# Altium schematic sheet 50-BLANK 101-120.SchDoc
size 594 x 420 mm
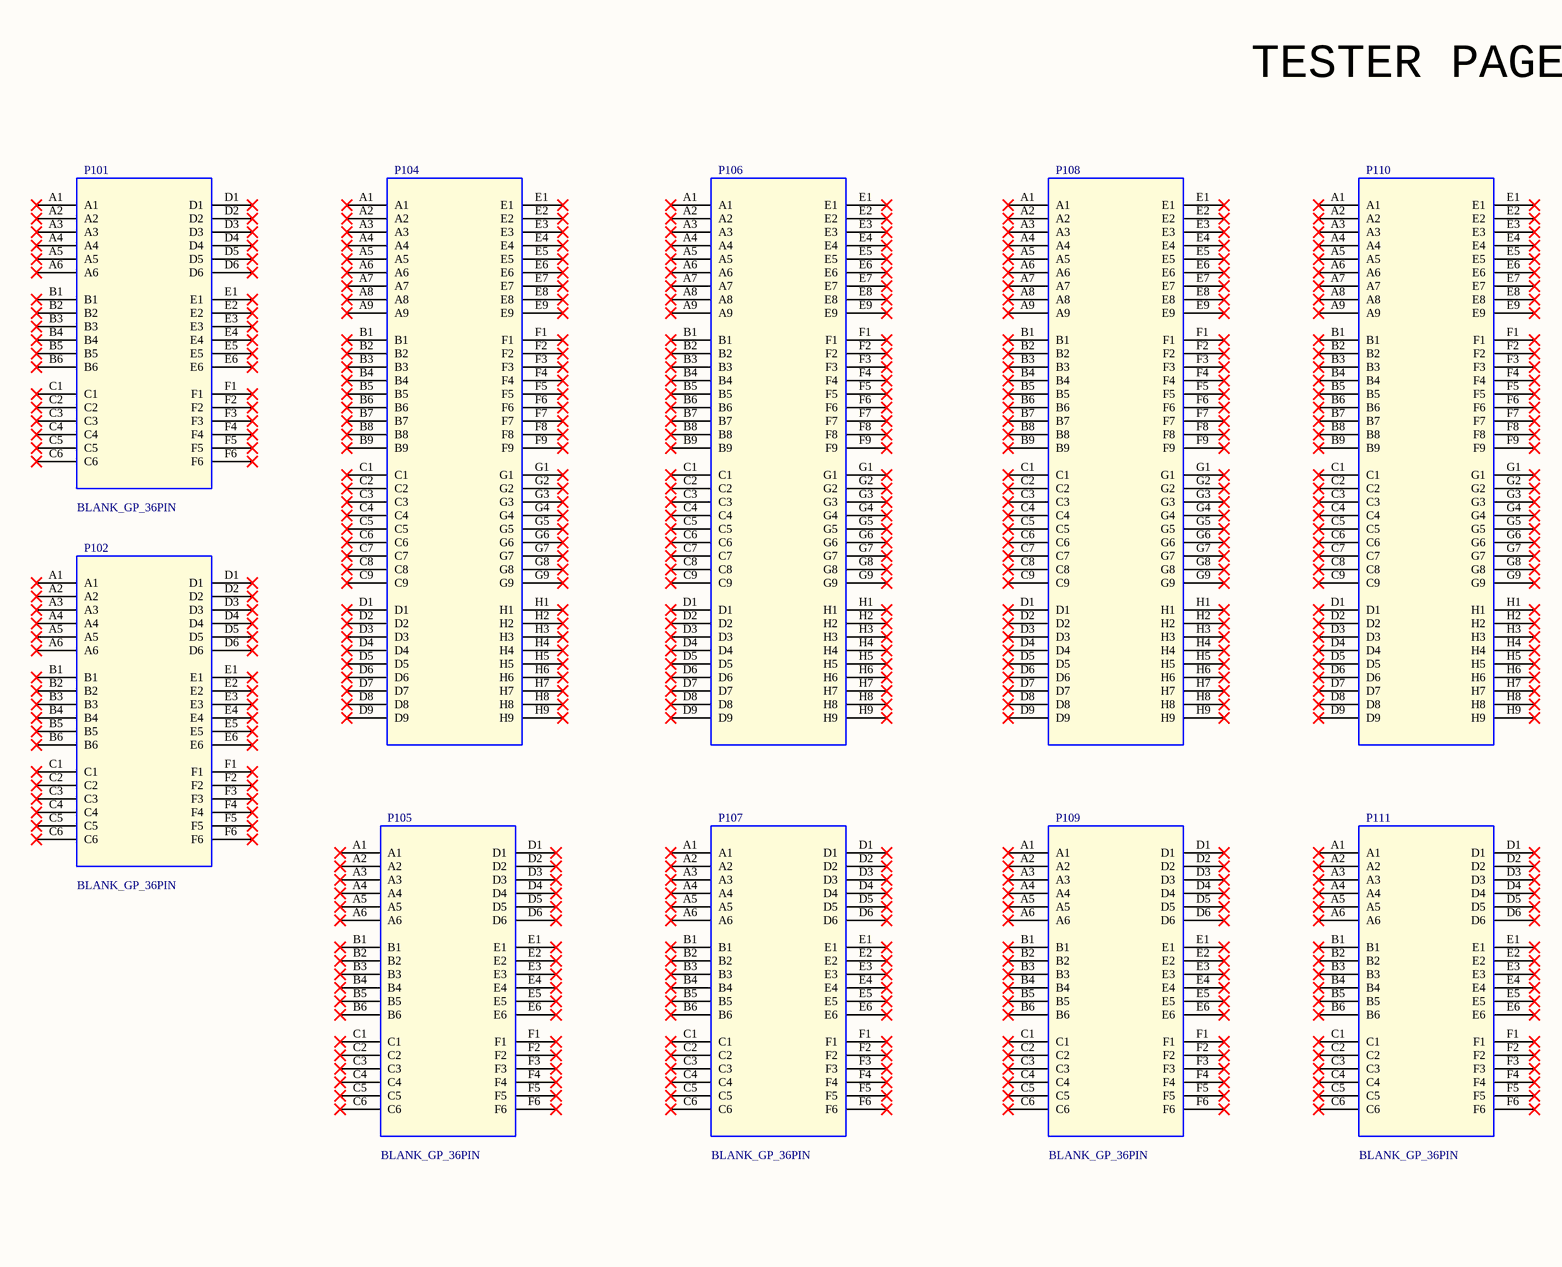
[diagram p0: 50-BLANK 101-120.SchDoc, left]
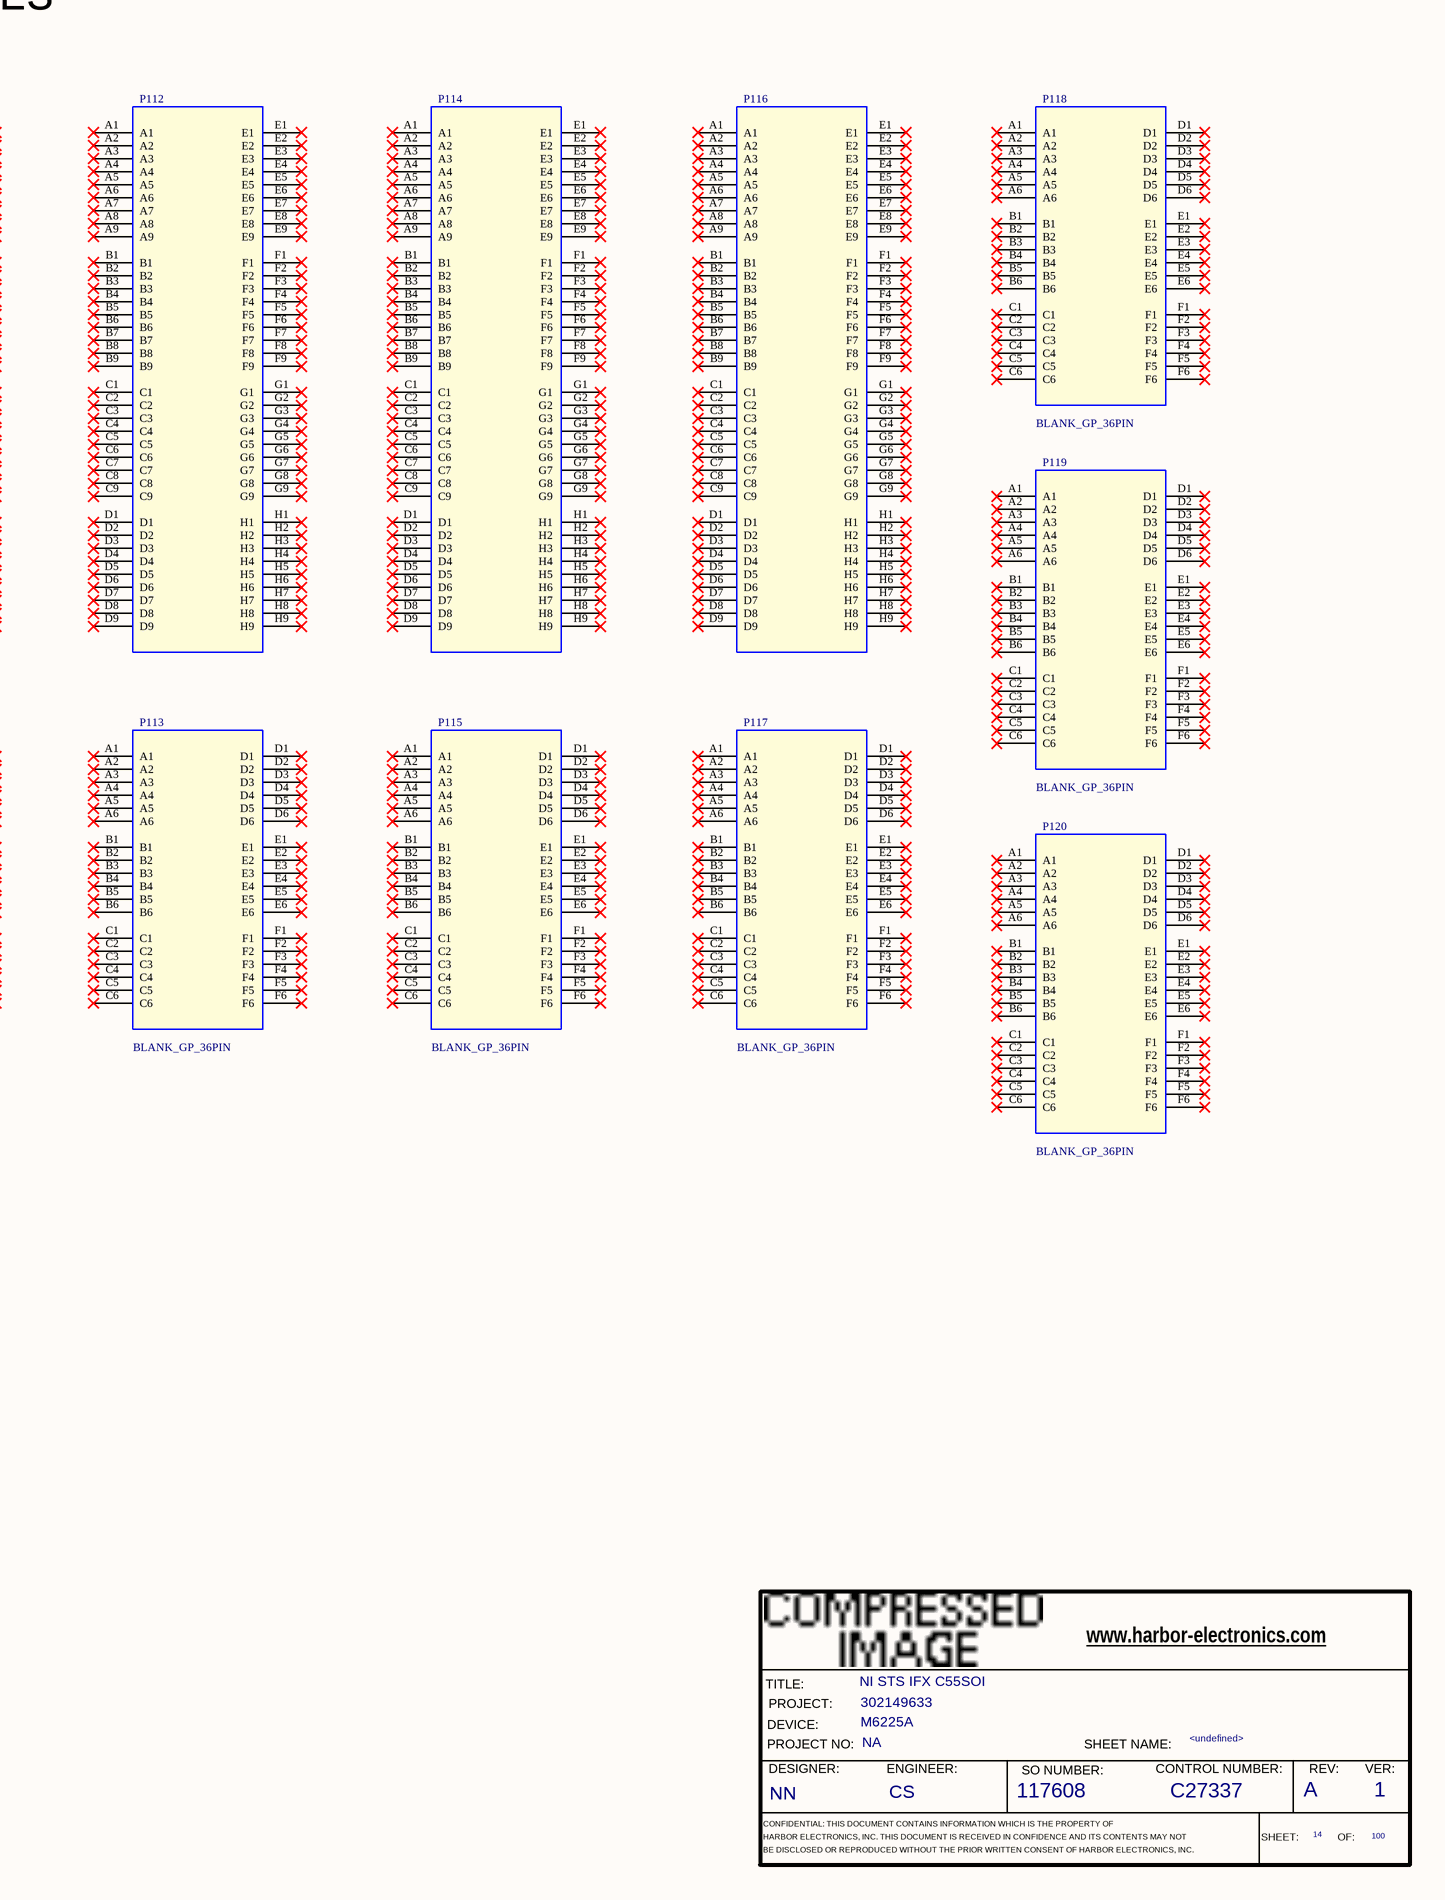
[diagram p1: 50-BLANK 101-120.SchDoc, right]

## Parts
*  RevCode: A  Title: NI STS IFX C55SOI  Page Number: 14  Page Count: 100  Engineer: CS  Designer: NN  SO Number: 117608  Control Number: C27337  Version: 1  Page Name: <undefined>  PROJECT: 302149633  DEVICE: M6225A  PROJECT NO.: NA  (hidden comment: HE_DEFAULT)  (graphical)
P101  BLANK_GP_36PIN  [285092A-08_36PIN_NOVIA]
P102  BLANK_GP_36PIN  [285092A-08_36PIN_NOVIA]
P104  (no value)  [285092A-08_72PIN_NOVIA]
P105  BLANK_GP_36PIN  [285092A-08_36PIN_NOVIA]
P106  (no value)  [285092A-08_72PIN_NOVIA]
P107  BLANK_GP_36PIN  [285092A-08_36PIN_NOVIA]
P108  (no value)  [285092A-08_72PIN_NOVIA]
P109  BLANK_GP_36PIN  [285092A-08_36PIN_NOVIA]
P110  (no value)  [285092A-08_72PIN_NOVIA]
P111  BLANK_GP_36PIN  [285092A-08_36PIN_NOVIA]
P112  (no value)  [285092A-08_72PIN_NOVIA]
P113  BLANK_GP_36PIN  [285092A-08_36PIN_NOVIA]
P114  (no value)  [285092A-08_72PIN_NOVIA]
P115  BLANK_GP_36PIN  [285092A-08_36PIN_NOVIA]
P116  (no value)  [285092A-08_72PIN_NOVIA]
P117  BLANK_GP_36PIN  [285092A-08_36PIN_NOVIA]
P118  BLANK_GP_36PIN  [285092A-08_36PIN_NOVIA]
P119  BLANK_GP_36PIN  [285092A-08_36PIN_NOVIA]
P120  BLANK_GP_36PIN  [285092A-08_36PIN_NOVIA]

## Nets

Not connected (* = marked no-connect by the designer): P101 A1* A2* A3* A4* A5* A6* B1* B2* B3* B4* B5* B6* C1* C2* C3* C4* C5* C6* D1* D2* D3* D4* D5* D6* E1* E2* E3* E4* E5* E6* F1* F2* F3* F4* F5* F6*; P102 A1* A2* A3* A4* A5* A6* B1* B2* B3* B4* B5* B6* C1* C2* C3* C4* C5* C6* D1* D2* D3* D4* D5* D6* E1* E2* E3* E4* E5* E6* F1* F2* F3* F4* F5* F6*; P104 A1* A2* A3* A4* A5* A6* A7* A8* A9* B1* B2* B3* B4* B5* B6* B7* B8* B9* C1* C2* C3* C4* C5* C6* C7* C8* C9* D1* D2* D3* D4* D5* D6* D7* D8* D9* E1* E2* E3* E4* E5* E6* E7* E8* E9* F1* F2* F3* F4* F5* F6* F7* F8* F9* G1* G2* G3* G4* G5* G6* G7* G8* G9* H1* H2* H3* H4* H5* H6* H7* H8* H9*; P105 A1* A2* A3* A4* A5* A6* B1* B2* B3* B4* B5* B6* C1* C2* C3* C4* C5* C6* D1* D2* D3* D4* D5* D6* E1* E2* E3* E4* E5* E6* F1* F2* F3* F4* F5* F6*; P106 A1* A2* A3* A4* A5* A6* A7* A8* A9* B1* B2* B3* B4* B5* B6* B7* B8* B9* C1* C2* C3* C4* C5* C6* C7* C8* C9* D1* D2* D3* D4* D5* D6* D7* D8* D9* E1* E2* E3* E4* E5* E6* E7* E8* E9* F1* F2* F3* F4* F5* F6* F7* F8* F9* G1* G2* G3* G4* G5* G6* G7* G8* G9* H1* H2* H3* H4* H5* H6* H7* H8* H9*; P107 A1* A2* A3* A4* A5* A6* B1* B2* B3* B4* B5* B6* C1* C2* C3* C4* C5* C6* D1* D2* D3* D4* D5* D6* E1* E2* E3* E4* E5* E6* F1* F2* F3* F4* F5* F6*; P108 A1* A2* A3* A4* A5* A6* A7* A8* A9* B1* B2* B3* B4* B5* B6* B7* B8* B9* C1* C2* C3* C4* C5* C6* C7* C8* C9* D1* D2* D3* D4* D5* D6* D7* D8* D9* E1* E2* E3* E4* E5* E6* E7* E8* E9* F1* F2* F3* F4* F5* F6* F7* F8* F9* G1* G2* G3* G4* G5* G6* G7* G8* G9* H1* H2* H3* H4* H5* H6* H7* H8* H9*; P109 A1* A2* A3* A4* A5* A6* B1* B2* B3* B4* B5* B6* C1* C2* C3* C4* C5* C6* D1* D2* D3* D4* D5* D6* E1* E2* E3* E4* E5* E6* F1* F2* F3* F4* F5* F6*; P110 A1* A2* A3* A4* A5* A6* A7* A8* A9* B1* B2* B3* B4* B5* B6* B7* B8* B9* C1* C2* C3* C4* C5* C6* C7* C8* C9* D1* D2* D3* D4* D5* D6* D7* D8* D9* E1* E2* E3* E4* E5* E6* E7* E8* E9* F1* F2* F3* F4* F5* F6* F7* F8* F9* G1* G2* G3* G4* G5* G6* G7* G8* G9* H1* H2* H3* H4* H5* H6* H7* H8* H9*; P111 A1* A2* A3* A4* A5* A6* B1* B2* B3* B4* B5* B6* C1* C2* C3* C4* C5* C6* D1* D2* D3* D4* D5* D6* E1* E2* E3* E4* E5* E6* F1* F2* F3* F4* F5* F6*; P112 A1* A2* A3* A4* A5* A6* A7* A8* A9* B1* B2* B3* B4* B5* B6* B7* B8* B9* C1* C2* C3* C4* C5* C6* C7* C8* C9* D1* D2* D3* D4* D5* D6* D7* D8* D9* E1* E2* E3* E4* E5* E6* E7* E8* E9* F1* F2* F3* F4* F5* F6* F7* F8* F9* G1* G2* G3* G4* G5* G6* G7* G8* G9* H1* H2* H3* H4* H5* H6* H7* H8* H9*; P113 A1* A2* A3* A4* A5* A6* B1* B2* B3* B4* B5* B6* C1* C2* C3* C4* C5* C6* D1* D2* D3* D4* D5* D6* E1* E2* E3* E4* E5* E6* F1* F2* F3* F4* F5* F6*; P114 A1* A2* A3* A4* A5* A6* A7* A8* A9* B1* B2* B3* B4* B5* B6* B7* B8* B9* C1* C2* C3* C4* C5* C6* C7* C8* C9* D1* D2* D3* D4* D5* D6* D7* D8* D9* E1* E2* E3* E4* E5* E6* E7* E8* E9* F1* F2* F3* F4* F5* F6* F7* F8* F9* G1* G2* G3* G4* G5* G6* G7* G8* G9* H1* H2* H3* H4* H5* H6* H7* H8* H9*; P115 A1* A2* A3* A4* A5* A6* B1* B2* B3* B4* B5* B6* C1* C2* C3* C4* C5* C6* D1* D2* D3* D4* D5* D6* E1* E2* E3* E4* E5* E6* F1* F2* F3* F4* F5* F6*; P116 A1* A2* A3* A4* A5* A6* A7* A8* A9* B1* B2* B3* B4* B5* B6* B7* B8* B9* C1* C2* C3* C4* C5* C6* C7* C8* C9* D1* D2* D3* D4* D5* D6* D7* D8* D9* E1* E2* E3* E4* E5* E6* E7* E8* E9* F1* F2* F3* F4* F5* F6* F7* F8* F9* G1* G2* G3* G4* G5* G6* G7* G8* G9* H1* H2* H3* H4* H5* H6* H7* H8* H9*; P117 A1* A2* A3* A4* A5* A6* B1* B2* B3* B4* B5* B6* C1* C2* C3* C4* C5* C6* D1* D2* D3* D4* D5* D6* E1* E2* E3* E4* E5* E6* F1* F2* F3* F4* F5* F6*; P118 A1* A2* A3* A4* A5* A6* B1* B2* B3* B4* B5* B6* C1* C2* C3* C4* C5* C6* D1* D2* D3* D4* D5* D6* E1* E2* E3* E4* E5* E6* F1* F2* F3* F4* F5* F6*; P119 A1* A2* A3* A4* A5* A6* B1* B2* B3* B4* B5* B6* C1* C2* C3* C4* C5* C6* D1* D2* D3* D4* D5* D6* E1* E2* E3* E4* E5* E6* F1* F2* F3* F4* F5* F6*; P120 A1* A2* A3* A4* A5* A6* B1* B2* B3* B4* B5* B6* C1* C2* C3* C4* C5* C6* D1* D2* D3* D4* D5* D6* E1* E2* E3* E4* E5* E6* F1* F2* F3* F4* F5* F6*

## Notes on the sheet
- TESTER PAGES
- (in symbol HE_DEFAULT) www.harbor-electronics.com; TITLE:; PROJECT:; DEVICE:; PROJECT NO:; SHEET NAME:; DESIGNER:; ENGINEER:; SO NUMBER:; CONTROL NUMBER:; REV:; VER:; CONFIDENTIAL: THIS DOCUMENT CONTAINS INFORMATION WHICH IS THE PROPERTY OF; HARBOR ELECTRONICS, INC. THIS DOCUMENT IS RECEIVED IN CONFIDENCE AND ITS CONTENTS MAY NOT; SHEET:; OF:; BE DISCLOSED OR REPRODUCED WITHOUT THE PRIOR WRITTEN CONSENT OF HARBOR ELECTRONICS, INC.

## Library data of the parts
* = HE_DEFAULT: Page Size: X; OrgAddr4: Fax: +1 602-431-9633; OrgAddr1: 4050 E. Cotton Center Blvd., Suite 33; OrgAddr2: Phoenix, Arizona 85040 U.S.A.; OrgAddr3: Phone: +1 602-438-1112; Doc: <Title Name>; OrgName: HARBOR
P101 P102 P105 P107 P109 P111 P113 P115 P117-P120 = BLANK_GP_36PIN: ALT_SYMBOLS: 285092A-08_36PIN; PCB Footprint: 285092A-08_36PIN_NOVIA
P104 P106 P108 P110 P112 P114 P116 = BLANK_COAX_72PIN: ALT_SYMBOLS: 285092A-08_72PIN; PCB Footprint: 285092A-08_72PIN_NOVIA